# Altium schematic sheet ScoreCount.SchDoc: Score Count
size A4
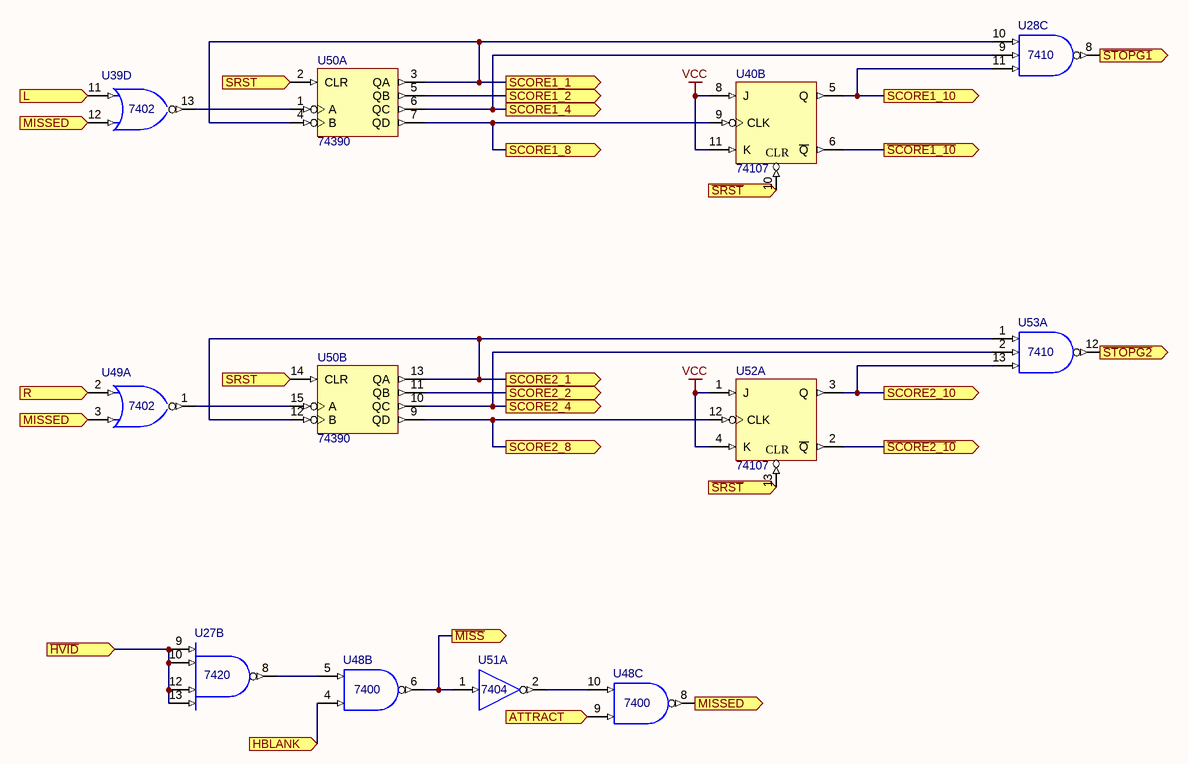
[diagram p0: ScoreCount.SchDoc]

## Parts
U27  7420  [N014]  (part B of 2)
U28  7410  [N014]  (part C of 3)
U39  7402  [N014]  (part D of 4)
U40  74107  [N014]  (part B of 2)
U48  7400  [N014]  (parts B,C of 4)
U49  7402  [N014]  (part A of 4)
U50  74390  [N016]  (parts A,B of 2)
U51  7404  [N014]  (part A of 6)
U52  74107  [N014]  (part A of 2)
U53  7410  [N014]  (part A of 3)

## Ports
ATTRACT, HBLANK, L, MISSED, R, SCORE1_1, SCORE1_2, SCORE1_4, SCORE1_8, SCORE1_10, SCORE2_1, SCORE2_2, SCORE2_4, SCORE2_8, SCORE2_10, SRST, ~{HVID}, ~{MISS}, ~{SCORE1_10}, ~{SCORE2_10}, ~{SRST}, ~{STOPG1}, ~{STOPG2}

## Nets
GND: U27.7(GND) U28.7(GND) U39.7(GND) U40.7(GND) U48.7(GND) U49.7(GND) U50.8(GND) U51.7(GND) U52.7(GND) U53.7(GND)
VCC: U27.14(VCC) U28.14(VCC) U39.14(VCC) U40.8(J) U40.11(K) U40.14(VCC) U48.14(VCC) U49.14(VCC) U50.16(VCC) U51.14(VCC) U52.1(J) U52.4(K) U52.14(VCC) U53.14(VCC)
~{HVID}: U27.9(A) U27.10(B) U27.12(C) U27.13(D) ; port ~{HVID}
~{MISS}: U48.6(Y) U51.1(A) ; port ~{MISS}
~{SCORE1_10}: U40.6(~{Q}) ; port ~{SCORE1_10}
~{SCORE2_10}: U52.2(~{Q}) ; port ~{SCORE2_10}
~{SRST}: U40.10(CLR) U52.13(CLR) ; port ~{SRST}
~{STOPG1}: U28.8(Y) ; port ~{STOPG1}
~{STOPG2}: U53.12(Y) ; port ~{STOPG2}
ATTRACT: U48.9(A) ; port ATTRACT
HBLANK: U48.4(A) ; port HBLANK
L: U39.11(A) ; port L
MISSED: U39.12(B) U48.8(Y) U49.3(B) ; port MISSED
R: U49.2(A) ; port R
SCORE1_1: U28.10(B) U50.3(QA) U50.4(B) ; port SCORE1_1
SCORE1_2: U50.5(QB) ; port SCORE1_2
SCORE1_4: U28.9(A) U50.6(QC) ; port SCORE1_4
SCORE1_8: U40.9(CLK) U50.7(QD) ; port SCORE1_8
SCORE1_10: U28.11(C) U40.5(Q) ; port SCORE1_10
SCORE2_1: U50.12(B) U50.13(QA) U53.1(A) ; port SCORE2_1
SCORE2_2: U50.11(QB) ; port SCORE2_2
SCORE2_4: U50.10(QC) U53.2(B) ; port SCORE2_4
SCORE2_8: U50.9(QD) U52.12(CLK) ; port SCORE2_8
SCORE2_10: U52.3(Q) U53.13(C) ; port SCORE2_10
SRST: U50.2(CLR) U50.14(CLR) ; port SRST
NetU27_8: U27.8(Y) U48.5(B)
NetU39_13: U39.13(Y) U50.1(A)
NetU48_10: U48.10(B) U51.2(Y)
NetU49_1: U49.1(Y) U50.15(A)

## Notes on the sheet
- Text
- Page
- PONG

## Library data of the parts
U27 = SN74LS20N: Dual 4-Input Positive-NAND Gate; Note: Pins 3 and 11 are NC & not drawn.; Published: 8-Jun-2000; LatestRevisionDate: 04-Mar-2005; LatestRevisionNote: Stylized 3D Model Added.; DatasheetVersion: Mar-1988; PackageVersion: Oct-1995; PackageReference: N014; Publisher: Altium Limited; PackageDescription: DIP; 14 Leads; Row Spacing 7.62 mm; Pitch 2.54 mm; ComponentLink1Description: Manufacturer Link; ComponentLink1URL: http://www.ti.com/; ComponentLink2Description: Datasheet; ComponentLink2URL: http://www-s.ti.com/sc/ds/sn74ls20.pdf
U28 U53 = SN74LS10N: Triple 3-Input Positive-NAND Gate; Published: 8-Jun-2000; LatestRevisionDate: 04-Mar-2005; LatestRevisionNote: Stylized 3D Model Added.; DatasheetVersion: Mar-1988; PackageVersion: Oct-1995; PackageReference: N014; Publisher: Altium Limited; PackageDescription: DIP; 14 Leads; Row Spacing 7.62 mm; Pitch 2.54 mm; ComponentLink1Description: Manufacturer Link; ComponentLink1URL: http://www.ti.com/; ComponentLink2Description: Datasheet; ComponentLink2URL: http://www-s.ti.com/sc/ds/sn74ls10.pdf
U39 U49 = SN74LS02N: Quadruple 2-Input Positive-NOR Gate; Published: 8-Jun-2000; LatestRevisionDate: 04-Mar-2005; LatestRevisionNote: Stylized 3D Model Added.; DatasheetVersion: Mar-1988; PackageVersion: Oct-1995; PackageReference: N014; Publisher: Altium Limited; PackageDescription: DIP; 14 Leads; Row Spacing 7.62 mm; Pitch 2.54 mm; ComponentLink1Description: Manufacturer Link; ComponentLink1URL: http://www.ti.com/; ComponentLink2Description: Datasheet; ComponentLink2URL: http://www-s.ti.com/sc/ds/sn54s02.pdf
U40 U52 = SN74LS107AN: Dual J-K Flip-Flop with Clear; Published: 8-Jun-2000; LatestRevisionDate: 04-Mar-2005; LatestRevisionNote: Stylized 3D Model Added.; DatasheetVersion: Mar-1988; PackageVersion: Oct-1995; PackageReference: N014; Publisher: Altium Limited; PackageDescription: DIP; 14 Leads; Row Spacing 7.62 mm; Pitch 2.54 mm; ComponentLink1Description: Manufacturer Link; ComponentLink1URL: http://www.ti.com/; ComponentLink2Description: Datasheet; ComponentLink2URL: http://www-s.ti.com/sc/ds/sn74ls107a.pdf
U48 = SN74LS00N: Quadruple 2-Input Positive-NAND Gate; Published: 8-Jun-2000; LatestRevisionDate: 04-Mar-2005; LatestRevisionNote: Stylized 3D Model Added.; DatasheetVersion: Mar-1988; PackageVersion: Oct-1995; PackageReference: N014; Publisher: Altium Limited; PackageDescription: DIP; 14 Leads; Row Spacing 7.62 mm; Pitch 2.54 mm; ComponentLink1Description: Manufacturer Link; ComponentLink1URL: http://www.ti.com/; ComponentLink2Description: Datasheet; ComponentLink2URL: http://www-s.ti.com/sc/ds/sn74ls00.pdf
U50 = SN74LS390N: Dual 4-Bit Decade and Binary Counter; Published: 8-Jun-2000; LatestRevisionDate: 04-Mar-2005; LatestRevisionNote: Stylized 3D Model Added.; DatasheetVersion: Mar-1988; PackageVersion: Oct-1995; PackageReference: N016; Publisher: Altium Limited; PackageDescription: DIP; 16 Leads; Row Spacing 7.62 mm; Pitch 2.54 mm; Code_JEDEC: MS-001-BB; ComponentLink1Description: Manufacturer Link; ComponentLink1URL: http://www.ti.com/; ComponentLink2Description: Datasheet; ComponentLink2URL: http://www-s.ti.com/sc/ds/sn74393.pdf
U51 = SN74LS04N: Hex Inverter; Published: 8-Jun-2000; LatestRevisionDate: 04-Mar-2005; LatestRevisionNote: Stylized 3D Model Added.; DatasheetVersion: Mar-1988; PackageVersion: Oct-1995; PackageReference: N014; Publisher: Altium Limited; PackageDescription: DIP; 14 Leads; Row Spacing 7.62 mm; Pitch 2.54 mm; ComponentLink1Description: Manufacturer Link; ComponentLink1URL: http://www.ti.com/; ComponentLink2Description: Datasheet; ComponentLink2URL: http://www-s.ti.com/sc/ds/sn74ls04.pdf